# EAGLE design RFM69_FlexyPin_Shield_0-E-shaped (EAGLE 9.6.2)
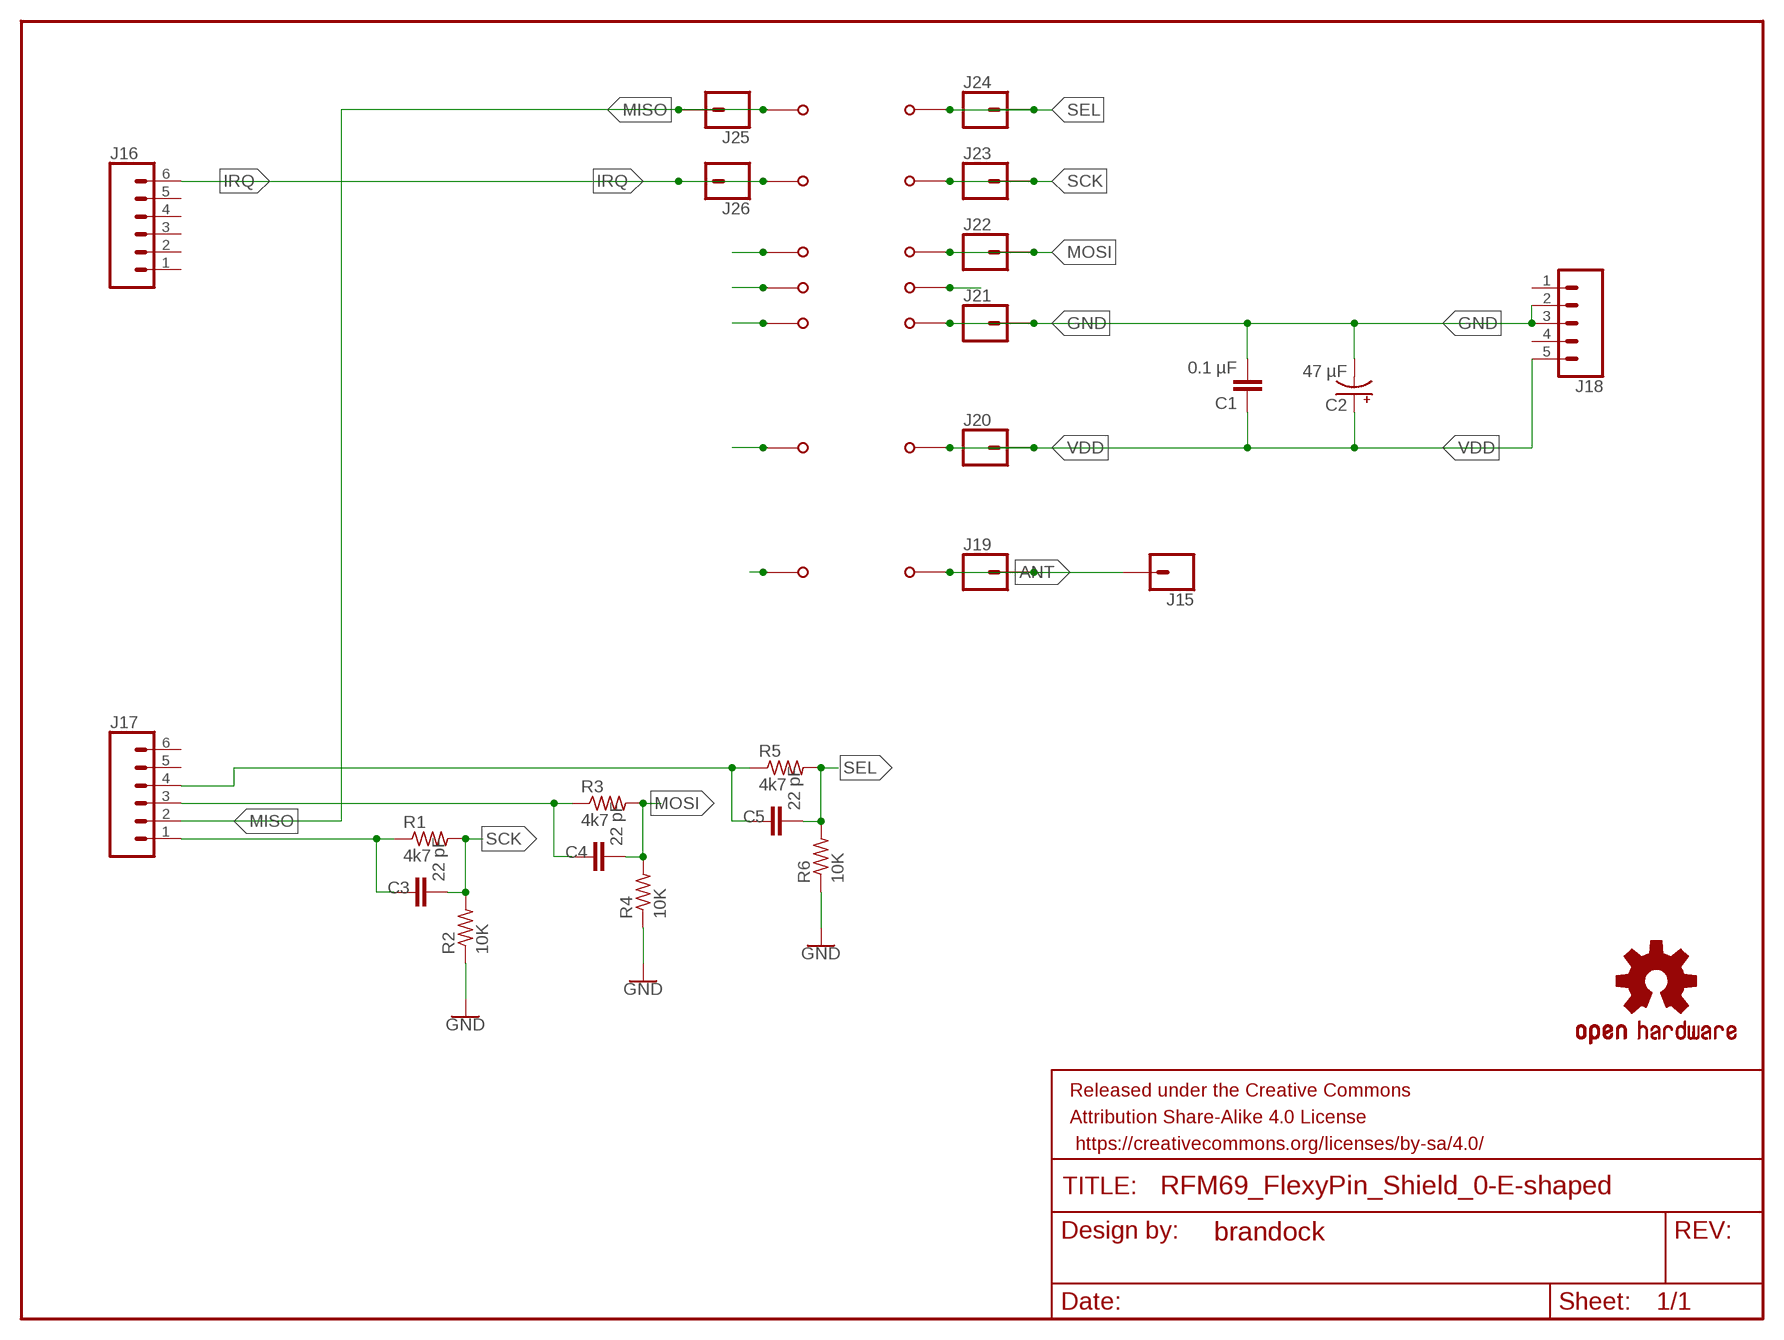
[diagram p0: schematic, sheet 1]

## Parts
C1  0.1 µF  C-EU025-024X044  [C025-024X044]
C2  47 µF  CPOL-USE2.5-6  [E2,5-6]
C3  22 pF  C-EU025-024X044  [C025-024X044]
C4  22 pF  C-EU025-024X044  [C025-024X044]
C5  22 pF  C-EU025-024X044  [C025-024X044]
FRAME1  FRAME-LETTERNO_PACKAGE  [DUMMY]
J1  FLEXYPIN  [FLEXYPIN]
J2  FLEXYPIN  [FLEXYPIN]
J3  FLEXYPIN  [FLEXYPIN]
J4  FLEXYPIN  [FLEXYPIN]
J5  FLEXYPIN  [FLEXYPIN]
J6  FLEXYPIN  [FLEXYPIN]
J7  FLEXYPIN  [FLEXYPIN]
J8  FLEXYPIN  [FLEXYPIN]
J9  FLEXYPIN  [FLEXYPIN]
J10  FLEXYPIN  [FLEXYPIN]
J11  FLEXYPIN  [FLEXYPIN]
J12  FLEXYPIN  [FLEXYPIN]
J13  FLEXYPIN  [FLEXYPIN]
J14  FLEXYPIN  [FLEXYPIN]
J15  CONN_01PTH_NO_SILK_YES_STOP  [1X01_NO_SILK]
J16  CONN_06LOCK  [1X06_LOCK]
J17  CONN_06LOCK  [1X06_LOCK]
J18  CONN_05LOCK  [1X05_LOCK]
J19  CONN_01PTH_NO_SILK_YES_STOP  [1X01_NO_SILK]
J20  CONN_01PTH_NO_SILK_YES_STOP  [1X01_NO_SILK]
J21  CONN_01PTH_NO_SILK_YES_STOP  [1X01_NO_SILK]
J22  CONN_01PTH_NO_SILK_YES_STOP  [1X01_NO_SILK]
J23  CONN_01PTH_NO_SILK_YES_STOP  [1X01_NO_SILK]
J24  CONN_01PTH_NO_SILK_YES_STOP  [1X01_NO_SILK]
J25  CONN_01PTH_NO_SILK_YES_STOP  [1X01_NO_SILK]
J26  CONN_01PTH_NO_SILK_YES_STOP  [1X01_NO_SILK]
LOGO1  OSHW-LOGOL  [OSHW-LOGO-L]
R1  4k7  R-US_0204/7  [0204/7]
R2  10K  R-US_0204/7  [0204/7]
R3  4k7  R-US_0204/7  [0204/7]
R4  10K  R-US_0204/7  [0204/7]
R5  4k7  R-US_0204/7  [0204/7]
R6  10K  R-US_0204/7  [0204/7]

## Nets
ANT: J14.P$1 J15.1 J19.1
GND: C1.2 C2.- J12.P$1 J18.2 J18.3 J21.1 R2.1 R4.1 R6.1
IRQ: J2.P$1 J16.6 J26.1
MISO: J1.P$1 J17.2 J25.1
MOSI: C4.2 J10.P$1 J22.1 R3.2 R4.2
N$1: J7.P$1
N$2: J3.P$1
N$3: C3.1 J17.1 R1.1
N$4: J4.P$1
N$5: J5.P$1
N$6: J6.P$1
N$7: C4.1 J17.3 R3.1
N$9: C5.1 J17.4 R5.1
N$11: J11.P$1
SCK: C3.2 J9.P$1 J23.1 R1.2 R2.2
SEL: C5.2 J8.P$1 J24.1 R5.2 R6.2
VDD: C1.1 C2.+ J13.P$1 J18.5 J20.1
Unconnected: J16.1 J16.2 J16.3 J16.4 J16.5 J17.5 J17.6 J18.1 J18.4

## Library data of the parts
C1 C3-C5 = rcl:C-EU: CAPACITOR, European symbol; SPICEPREFIX: C
C2 = rcl:CPOL-US: POLARIZED CAPACITOR, American symbol; SPICEPREFIX: C
FRAME1 = SparkFun-Aesthetics:FRAME-LETTER: Schematic Frame - Letter Standard 8.5x11 US Letter frame; DESIGNER: brandock; VERSION: v01
J1-J14 = FlexyPin:FLEXYPIN
J15 J19-J26 = SparkFun-Connectors:CONN_01: Single connection point. Often used as Generic Header-pin footprint for 0.1 inch spaced/style header connections On any of the 0.1 inch spaced packages, you can populate with these: Break Away Headers - Straight <https://www.sparkfun.com/products/116> (PRT-00116) Break Away Male Headers - Right Angle <https://www.sparkfun.com/products/553> (PRT-00553) Female Headers <https://www.sparkfun.com/products/115> (PRT-00115) Break Away Headers - Machine Pin <https://www.sparkfun.com/products/117> (PRT-00117) Break Away Female Headers - Swiss Machine Pin <https://www.sparkfun.com/products/743> (PRT-00743) This device is also useful as a general connection point to wire up your design to another part of your project. Our various solder wires solder well into these plated through hole pads. Hook-Up Wire - Assortment (Stranded, 22 AWG) <https://www.sparkfun.com/products/11375> (PRT-11375) Hook-Up Wire - Assortment (Solid Core, 22 AWG) <https://www.sparkfun.com/products/11367> (PRT-11367) View the entire wire category on our website here <https://www.sparkfun.com/categories/141> Special notes: SMTSO-256-ET is a "flush mount" nut for a 4-40 screw. We mostly use this on specialty testbeds; it is a nice way to connect hardware to your PCB at an adjustable hieght. Also note, the SNAP packages are for using a snappable style connector. We sell a baggie of snaps and they are also used on two LilyPad designs: Snap Assortment - 30 pack (male and female) <https://www.sparkfun.com/products/11347> (DEV-11347) LilyPad Arduino SimpleSnap <https://www.sparkfun.com/products/10941> (DEV-10941) LilyPad SimpleSnap Protoboard <https://www.sparkfun.com/products/10940> (DEV-10940)
J16 J17 = SparkFun-Connectors:CONN_06: Multi connection point. Often used as Generic Header-pin footprint for 0.1 inch spaced/style header connections On any of the 0.1 inch spaced packages, you can populate with these: Break Away Headers - Straight <https://www.sparkfun.com/products/116> (PRT-00116) Break Away Male Headers - Right Angle <https://www.sparkfun.com/products/553> (PRT-00553) Female Headers <https://www.sparkfun.com/products/115> (PRT-00115) Break Away Headers - Machine Pin <https://www.sparkfun.com/products/117> (PRT-00117) Break Away Female Headers - Swiss Machine Pin <https://www.sparkfun.com/products/743> (PRT-00743) Arduino Stackable Header - 6 Pin <https://www.sparkfun.com/products/9280> (PRT-09280) For SCREWTERMINALS and SPRING TERMINALS visit here: Screw Terimnals on SparkFun.com <https://www.sparkfun.com/search/results?term=Screw+Terminals> (5mm/3.5mm/2.54mm spacing) This device is also useful as a general connection point to wire up your design to another part of your project. Our various solder wires solder well into these plated through hole pads. Hook-Up Wire - Assortment (Stranded, 22 AWG) <https://www.sparkfun.com/products/11375> (PRT-11375) Hook-Up Wire - Assortment (Solid Core, 22 AWG) <https://www.sparkfun.com/products/11367> (PRT-11367) View the entire wire category on our website here <https://www.sparkfun.com/categories/141>
J18 = SparkFun-Connectors:CONN_05: Multi connection point. Often used as Generic Header-pin footprint for 0.1 inch spaced/style header connections On any of the 0.1 inch spaced packages, you can populate with these: Break Away Headers - Straight <https://www.sparkfun.com/products/116> (PRT-00116) Break Away Male Headers - Right Angle <https://www.sparkfun.com/products/553> (PRT-00553) Female Headers <https://www.sparkfun.com/products/115> (PRT-00115) Break Away Headers - Machine Pin <https://www.sparkfun.com/products/117> (PRT-00117) Break Away Female Headers - Swiss Machine Pin <https://www.sparkfun.com/products/743> (PRT-00743) For SCREWTERMINALS and SPRING TERMINALS visit here: Screw Terimnals on SparkFun.com <https://www.sparkfun.com/search/results?term=Screw+Terminals> (5mm/3.5mm/2.54mm spacing) This device is also useful as a general connection point to wire up your design to another part of your project. Our various solder wires solder well into these plated through hole pads. Hook-Up Wire - Assortment (Stranded, 22 AWG) <https://www.sparkfun.com/products/11375> (PRT-11375) Hook-Up Wire - Assortment (Solid Core, 22 AWG) <https://www.sparkfun.com/products/11367> (PRT-11367) View the entire wire category on our website here <https://www.sparkfun.com/categories/141> Special notes: Molex polarized connector foot print use with SKU : PRT-08231 with associated crimp pins and housings. 1MM SMD Version SKU: PRT-10208
LOGO1 = SparkFun-Aesthetics:OSHW-LOGO: Open-Source Hardware (OSHW) Logo This logo indicates the piece of hardware it is found on incorporates a OSHW license and/or adheres to the definition of open source hardware found here: http://freedomdefined.org/OSHW
R1-R6 = rcl:R-US_: RESISTOR, American symbol; SPICEPREFIX: R

## Board
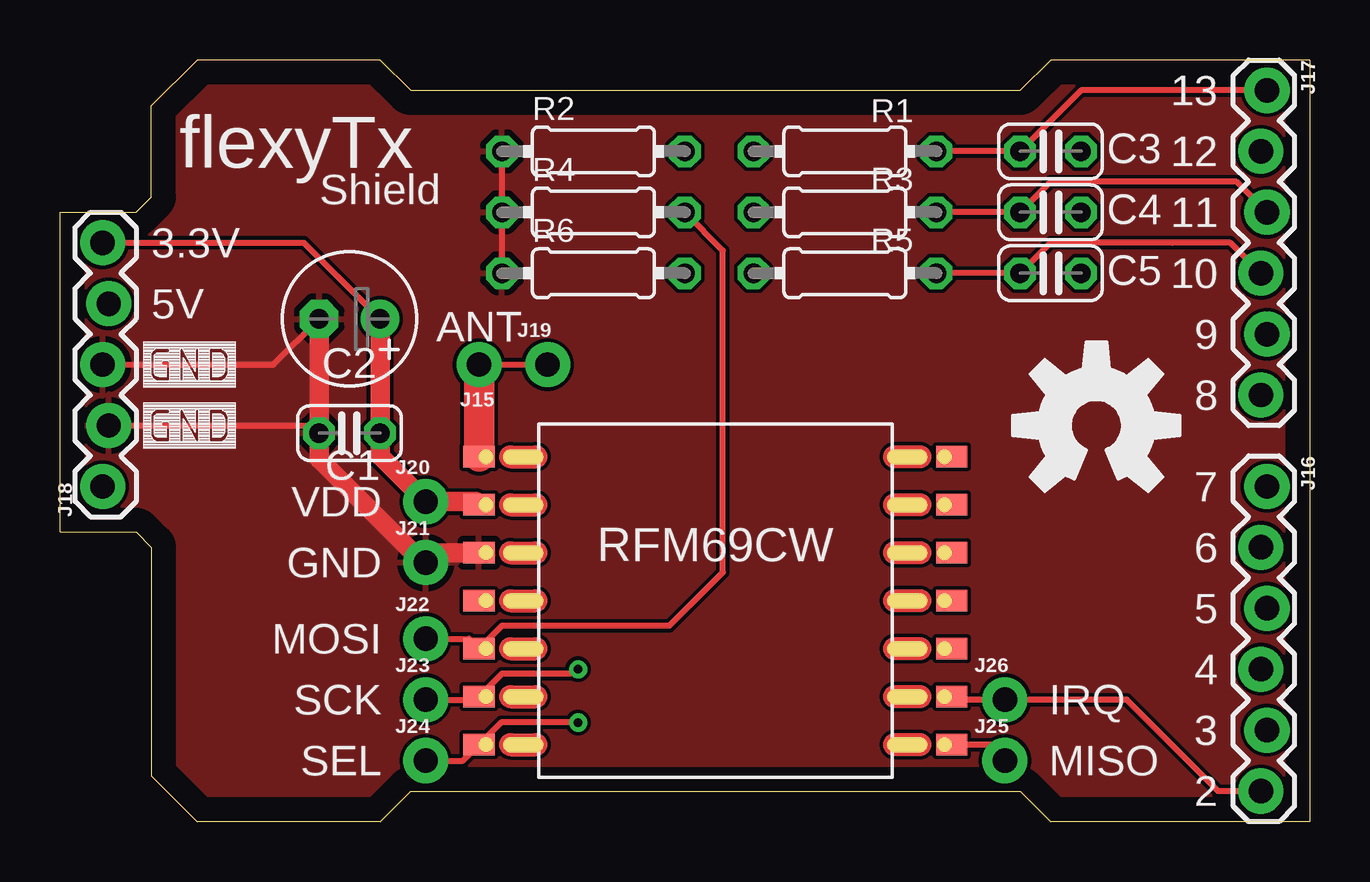
[diagram p1: board, top side]
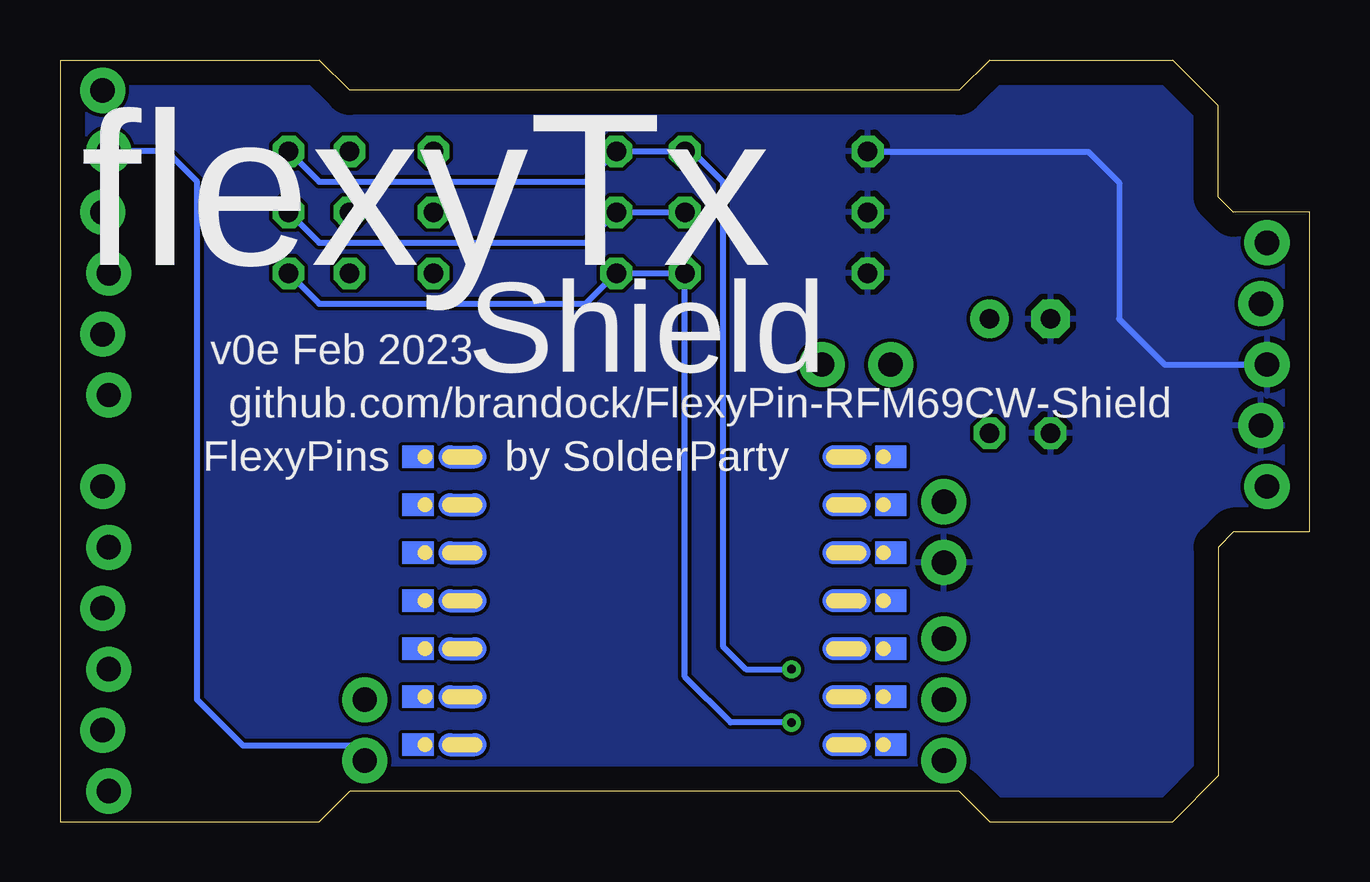
[diagram p2: board, bottom side, seen from below]

Size 52.07 x 31.75 mm. Coordinates in mm from the lower left corner, seen from the top.
Outline: 52.07,0 41.27,0 40.01,1.27 14.61,1.27 13.34,0 5.71,0 3.81,1.9 3.81,11.43 3.17,12.07 0,12.07 0,25.4 3.17,25.4 3.81,26.04 3.81,29.84 5.71,31.75 13.34,31.75 14.61,30.48 40.01,30.48 41.27,31.75 52.07,31.75 52.07,0
Copper layers (1*16): Top 0.035mm / dielectric 1.5mm / Bottom 0.035mm
Design rules "default": minimum track width 6mil, minimum drill 0.35mm, track to track 6mil, track to pad 6mil, pad to pad 6mil, via to via 6mil, smd to smd 6mil, copper to edge 40mil, drill to drill 6mil, minimum pad ring 10mil, minimum via ring 8mil, stop-mask expansion 4mil, vias tented up to drill 0mil, thermal gap 10mil

### Footprints (pad centres in the part's own frame; a part is rotated, then mirrored left to right if it is on the bottom)
C025-024X044 = drill 0.813 octagon: 1 -1.27,0; 2 1.27,0
E2,5-6 = drill 0.813 pad 1.6: + -1.27,0 | drill 0.813 pad 1.6 octagon: - 1.27,0
FLEXYPIN = smd 1.3 x 0.9: P$1 -1.85,0
1X01_NO_SILK = drill 1.016 pad 1.88: 1 0,0
1X06_LOCK = drill 1.016 pad 1.88: 1 0,0; 2 2.54,-0.254; 3 5.08,0; 4 7.62,-0.254; 5 10.16,0; 6 12.7,-0.254
1X05_LOCK = drill 1.016 pad 1.88: 1 0,0.127; 2 2.54,-0.127; 3 5.08,0.127; 4 7.62,-0.127; 5 10.16,0.127
0204/7 = drill 0.813 octagon: 1 -3.81,0; 2 3.81,0

### Placement (x,y rotation side)
C1  12.06,16.19 180 top
C2  12.06,20.96 180 top
C3  41.27,27.94 0 top
C4  41.27,25.4 0 top
C5  41.27,22.86 0 top
FRAME1  -33.66,19.05 0 top  (outside the outline)
J1  35.3,3.21 180 top
J2  35.3,5.21 180 top
J3  35.3,7.21 180 top
J4  35.3,9.21 180 top
J5  35.3,11.21 180 top
J6  35.3,13.21 180 top
J7  35.3,15.21 180 top
J8  19.3,3.21 0 top
J9  19.3,5.21 0 top
J10  19.3,7.21 0 top
J11  19.3,9.21 0 top
J12  19.3,11.21 0 top
J13  19.3,13.21 0 top
J14  19.3,15.21 0 top
J15  17.46,19.05 180 top
J16  50.29,13.97 270 top
J17  50.29,30.48 270 top
J18  1.91,13.97 90 top
J19  20.32,19.05 0 top
J20  15.24,13.34 0 top
J21  15.24,10.79 0 top
J22  15.24,7.62 0 top
J23  15.24,5.08 0 top
J24  15.24,2.54 0 top
J25  39.37,2.54 0 top
J26  39.37,5.08 0 top
LOGO1  43.18,16.51 0 top
LOGO2  OSHW-LOGOL  [OSHW-LOGO-L]  43.18,16.51 0 top
R1  32.7,27.94 180 top
R2  22.22,27.94 0 top
R3  32.7,25.4 180 top
R4  22.22,25.4 0 top
R5  32.7,22.86 180 top
R6  22.22,22.86 0 top

### Tracks (layer width: path | path; a pad name or v marks a point on that pad's centre or on a via)
ANT
  Top 0.254: J15.1 J19.1
  Top 0.813: J14.P$1
  Top 1.27: J14.P$1 J15.1
GND
  Top 0.254: R2.1 R4.1 R6.1 | C2.- 8.89,19.05 J18.3 | C1.2 10.48,16.51 J18.2
  Top 0.813: C2.- C1.2 10.79,15.11 15.11,10.79 J21.1 15.65,11.21 J12.P$1
  Bottom 0.254: 18.39,27.92 10.79,27.92 10.64,27.92 9.21,27.92 7.94,26.65 7.94,20.96 6.03,19.05 J18.3
  Bottom 0.406: R2.1 18.39,27.92
  pour Top: 52.07,0 1.27,0 0,1.27 0,31.11 0.64,31.75 52.07,31.75
  pour Bottom: 52.07,0 1.27,0 0,1.27 0,31.11 0.64,31.75 52.07,31.75
IRQ
  Top 0.254: J16.6 48.26,1.27 44.45,5.08 J26.1 37.28,5.08
  Top 0.406: J2.P$1 37.28,5.08
MISO
  Top 0.254: J25.1 39.37,3.18 39.34,3.21 J1.P$1
  Bottom 0.254: J25.1 39.37,3.18 44.45,3.18 46.36,5.08 46.36,23.81 46.36,24.13 46.36,26.67 47.62,27.94 J17.2
MOSI
  Top 0.254: R4.2 27.62,23.81 27.62,10.39 25.39,8.16 18.41,8.16 J10.P$1 17.04,7.62 J22.1
  Bottom 0.254: R4.2 R3.2 30.16,24.13 41.27,24.13 C4.2
N$3
  Top 0.254: J17.1 42.55,30.48 C3.1 R1.1
N$7
  Top 0.254: J17.3 49.02,26.67 41.27,26.67 C4.1 R3.1
N$9
  Top 0.254: J17.4 48.77,24.13 46.36,24.13 | 46.36,24.13 41.27,24.13 C5.1 R5.1 | 46.36,24.13
SCK  (via drill 0.35)
  Top 0.254: v21.59,6.35 21.45,6.35 21.26,6.16 18.41,6.16 J9.P$1 17.33,5.08 J23.1
  Bottom 0.254: C3.2 41.27,26.67 30.16,26.67 R1.2 R2.2 25.72,27.94 24.45,26.67 24.45,7.3 23.49,6.35 v21.59,6.35
SEL  (via drill 0.35)
  Top 0.254: v21.59,4.13 18.38,4.13 J8.P$1 16.79,2.54 J24.1
  Bottom 0.254: v21.59,4.13 24.13,4.13 26.04,6.03 R6.2 R5.2 30.16,21.59 41.27,21.59 C5.2
VDD
  Top 0.254: C2.+ 10.16,24.13 J18.5
  Top 0.813: C2.+ C1.1 13.34,15.24 J20.1 17.33,13.34 J13.P$1

### Text on the board
tPlace: 13 | flexyTx | 12 | Shield | 11 | 3.3V | 10 | 5V | ANT | 9 | 8 | VDD | 7 | RFM69CW | 6 | GND | 5 | MOSI | 4 | SCK | IRQ | 3 | SEL | MISO | 2
bPlace: flexyTx | Shield | v0e Feb 2023 | github.com/brandock/FlexyPin-RFM69CW-Shield | by SolderParty | FlexyPins
Measures: ATMega328 DIP